# EAGLE schematic negativeSupply_A (EAGLE 7.2.0)
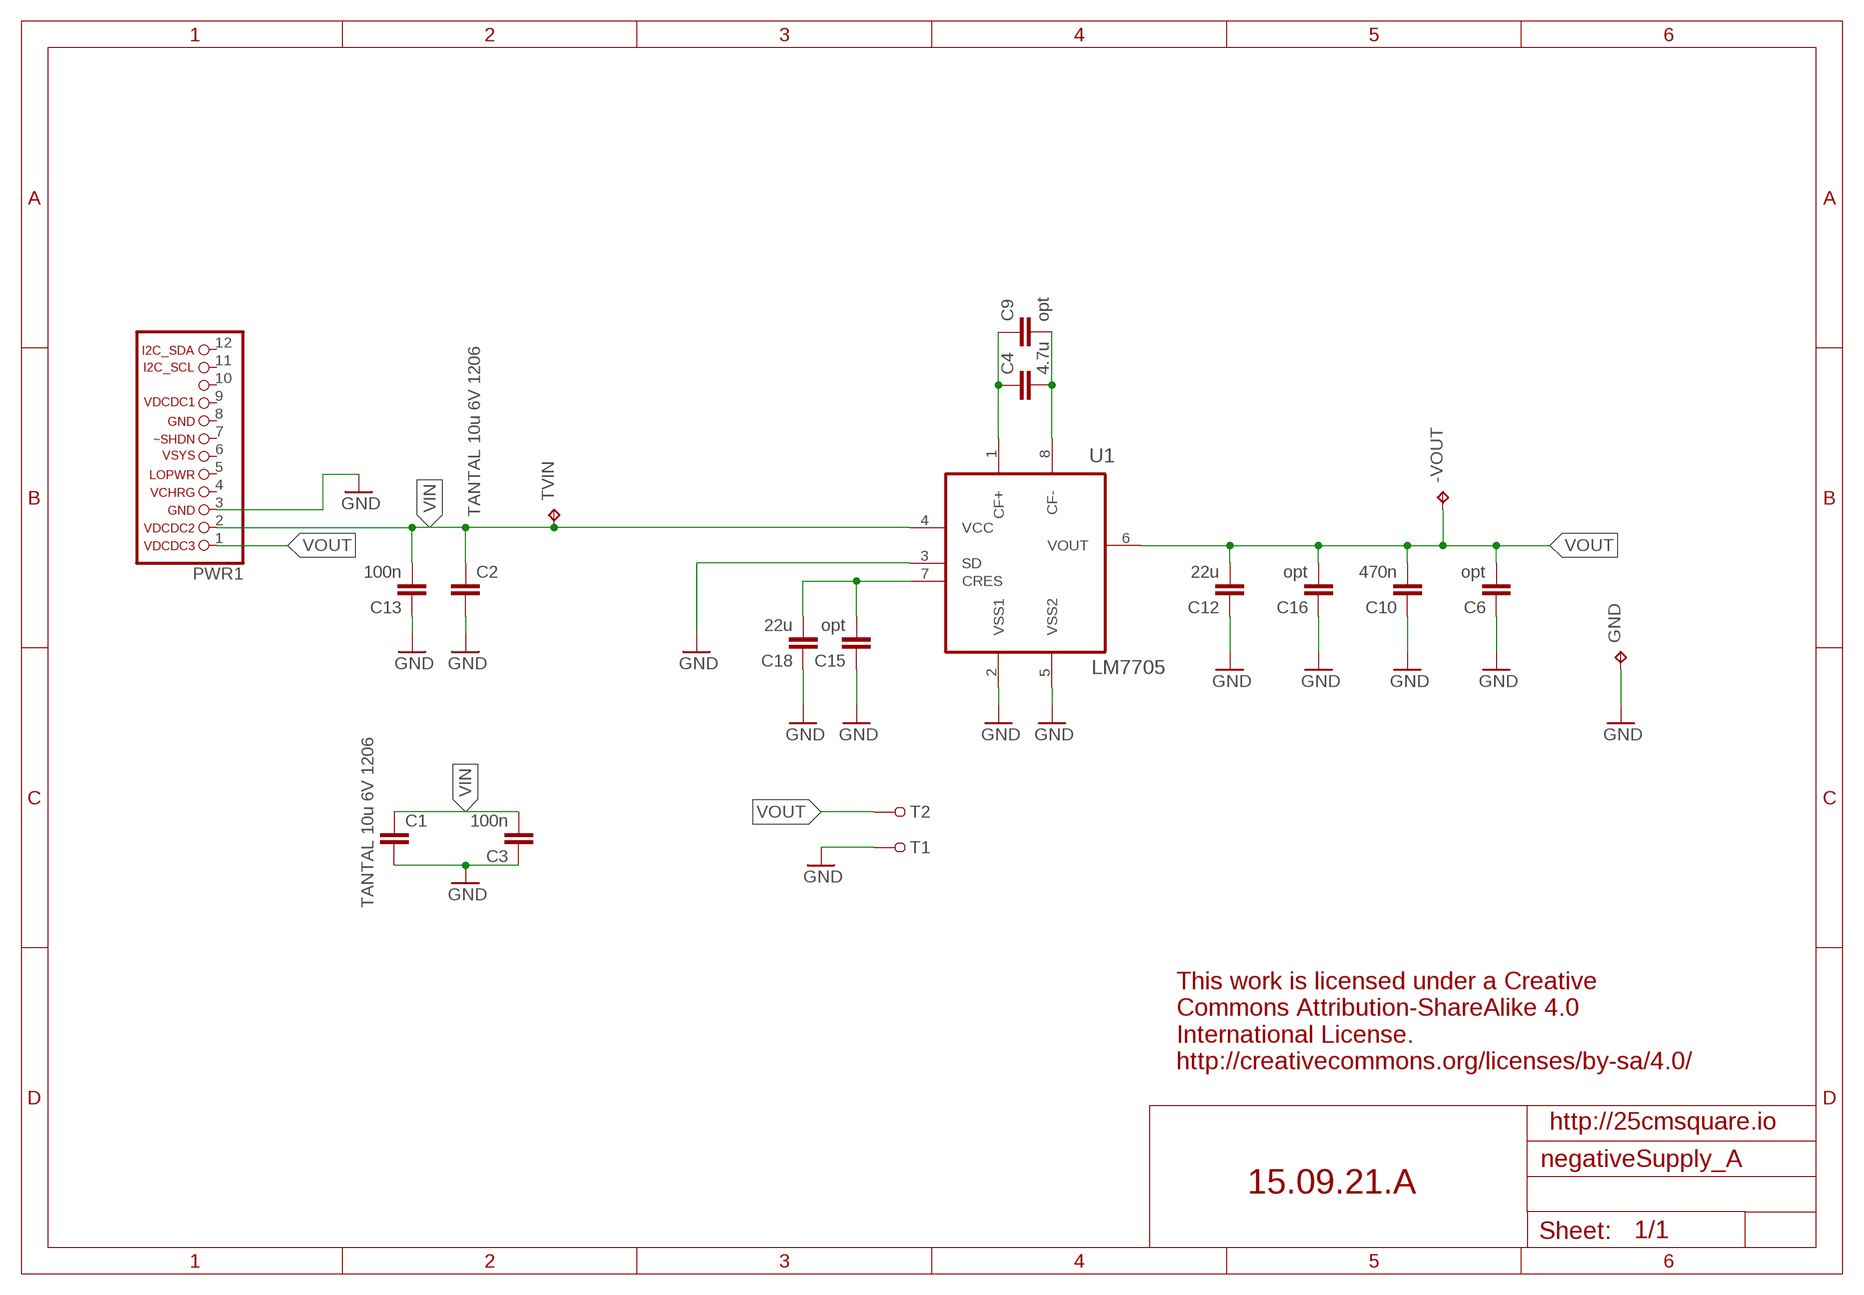
[diagram p0: schematic, sheet 1]

## Parts
-VOUT  TPTP14R  [TP14R]
C1  TANTAL 10u 6V 1206  C-EUC1206K  [C1206K]
C2  TANTAL 10u 6V 1206  C-EUC1206K  [C1206K]
C3  100n  C-EUC0805K  [C0805K]
C4  4.7u  C-EUC0805K  [C0805K]
C6  opt  C-EUC0805K  [C0805K]
C9  opt  C-EUC0805K  [C0805K]
C10  470n  C-EUC0805K  [C0805K]
C12  22u  C-EUC0805K  [C0805K]
C13  100n  C-EUC0805K  [C0805K]
C15  opt  C-EUC0805K  [C0805K]
C16  opt  C-EUC0805K  [C0805K]
C18  22u  C-EUC0805K  [C0805K]
GND  TPTP14R  [TP14R]
PWR1  LIWE_12_PIN_PWR  [LIWE_12_PIN]
T1  TEST-22-MULTICOMP  [TEST_1MM]
T2  TEST-22-MULTICOMP  [TEST_1MM]
TVIN  TPTP14R  [TP14R]
U1  LM7705  [VSSOP-8]

## Nets
GND: C1.2 C2.2 C3.1 C6.1 C10.1 C12.1 C13.1 C15.1 C16.1 C18.1 GND.TP PWR1.3 T1.1 U1.2(VSS1) U1.3(SD) U1.5(VSS2)
N$4: C4.1 C9.1 U1.1(CF+)
N$5: C4.2 C9.2 U1.8(CF-)
N$8: C15.2 C18.2 U1.7(CRES)
VIN: C1.1 C2.1 C3.2 C13.2 PWR1.2 TVIN.TP U1.4(VCC)
VOUT: -VOUT.TP C6.2 C10.2 C12.2 C16.2 PWR1.1 T2.1 U1.6(VOUT)
Unconnected: PWR1.4 PWR1.5 PWR1.6 PWR1.7 PWR1.8 PWR1.9 PWR1.10 PWR1.11 PWR1.12

## Notes on the sheet
- This work is licensed under a Creative
  Commons Attribution-ShareAlike 4.0
  International License.
  http://creativecommons.org/licenses/by-sa/4.0/
- http://25cmsquare.io
- 15.09.21.A

## Library data of the parts
-VOUT GND TVIN = testpad:TP: Test pad
C1-C4 C6 C9 C10 C12 C13 C15 C16 C18 = resistor:C-EU: CAPACITOR, European symbol; SPICEPREFIX: C
PWR1 = pma:LIWE_12_PIN_PWR
T1 T2 = pma:TEST-22-MULTICOMP: MULTICOMP TEST-22 TEST PIN, PCB, 1.0MM FARNELL: 1702010
U1 = pma:LM7705: LM7705 LM7705 Low Noise Negative Bias Generator